# EAGLE design G020H (EAGLE 6.6.0)
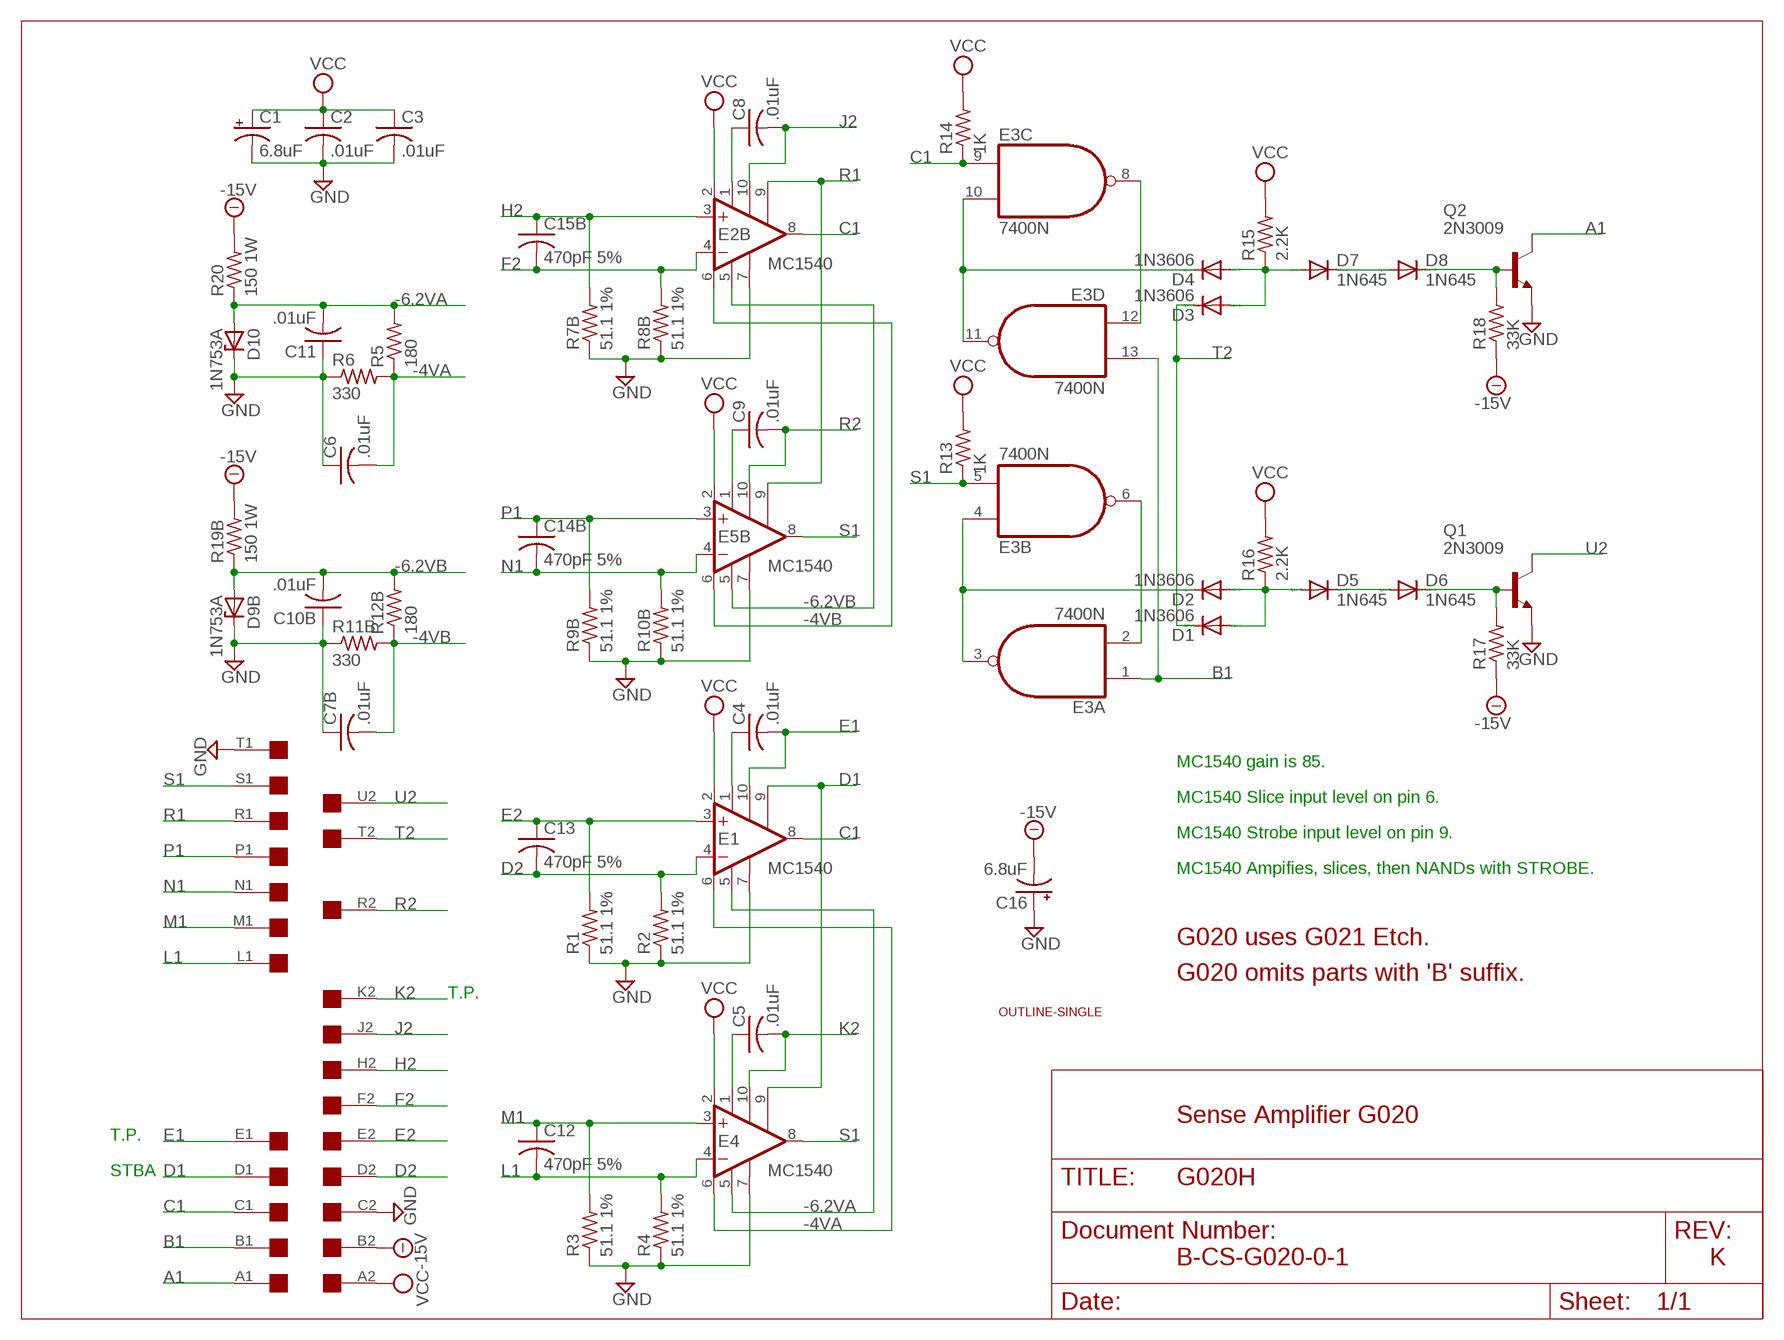
[diagram p0: schematic, sheet 1]

## Parts
C1  6.8uF  CPOL-USE20-8AXIAL  [E12-8]
C2  .01uF  C-US050-025X075  [C050-025X075]
C3  .01uF  C-US050-025X075  [C050-025X075]
C4  .01uF  C-US050-025X075  [C050-025X075]
C5  .01uF  C-US050-025X075  [C050-025X075]
C6  .01uF  C-US050-025X075  [C050-025X075]
C7B  .01uF  C-US050-025X075  [C050-025X075]
C8  .01uF  C-US050-025X075  [C050-025X075]
C9  .01uF  C-US050-025X075  [C050-025X075]
C10B  .01uF  C-US050-025X075  [C050-025X075]
C11  .01uF  C-US050-025X075  [C050-025X075]
C12  470pF 5%  C-US050-025X075  [C050-025X075]
C13  470pF 5%  C-US050-025X075  [C050-025X075]
C14B  470pF 5%  C-US050-025X075  [C050-025X075]
C15B  470pF 5%  C-US050-025X075  [C050-025X075]
C16  6.8uF  CPOL-USE20-8AXIAL  [E12-8]
D1  1N3606  1N4148DO35-10  [DO35-10]
D2  1N3606  1N4148DO35-10  [DO35-10]
D3  1N3606  1N4148DO35-10  [DO35-10]
D4  1N3606  1N4148DO35-10  [DO35-10]
D5  1N645  1N4148DO35-10  [DO35-10]
D6  1N645  1N4148DO35-10  [DO35-10]
D7  1N645  1N4148DO35-10  [DO35-10]
D8  1N645  1N4148DO35-10  [DO35-10]
D9B  1N753A  ZENER-DIODEDO35Z10  [DO35Z10]
D10  1N753A  ZENER-DIODEDO35Z10  [DO35Z10]
E1  MC1540  MC1540G  [602B]
E2B  MC1540  MC1540G  [602B]
E3  7400N  [DIL14]
E4  MC1540  MC1540G  [602B]
E5B  MC1540  MC1540G  [602B]
Q1  2N3009  2N2219  [TO5]
Q2  2N3009  2N2219  [TO5]
R1  51.1 1%  R-US_0207/15  [0207/15]
R2  51.1 1%  R-US_0207/15  [0207/15]
R3  51.1 1%  R-US_0207/15  [0207/15]
R4  51.1 1%  R-US_0207/15  [0207/15]
R5  180  R-US_0207/10  [0207/10]
R6  330  R-US_0207/10  [0207/10]
R7B  51.1 1%  R-US_0207/15  [0207/15]
R8B  51.1 1%  R-US_0207/15  [0207/15]
R9B  51.1 1%  R-US_0207/15  [0207/15]
R10B  51.1 1%  R-US_0207/15  [0207/15]
R11B  330  R-US_0207/10  [0207/10]
R12B  180  R-US_0207/10  [0207/10]
R13  1K  R-US_0207/10  [0207/10]
R14  1K  R-US_0207/10  [0207/10]
R15  2.2K  R-US_0207/10  [0207/10]
R16  2.2K  R-US_0207/10  [0207/10]
R17  33K  R-US_0207/10  [0207/10]
R18  33K  R-US_0207/10  [0207/10]
R19B  150 1W  R-US_0414/20  [0414/20]
R20  150 1W  R-US_0414/20  [0414/20]
U$1  SINGLE  [EDGE-CON2]
U$2  OUTLINE-SINGLE  [SINGLE]

## Nets
-4VA: C6.2 E1.6(SLICE) E4.6(SLICE) R5.1 R6.2
-4VB: C7B.2 E2B.6(SLICE) E5B.6(SLICE) R11B.2 R12B.1
-6.2VA: C11.2 D10.A E1.5(V-) E4.5(V-) R5.2 R20.1
-6.2VB: C10B.2 D9B.A E2B.5(V-) E5B.5(V-) R12B.2 R19B.1
-15V [Supply]: C16.- R17.1 R18.1 R19B.2 R20.2 U$1.B2
A1: Q2.3(C) U$1.A1
B1: E3.1(A:I0) E3.13(D:I1) U$1.B1
C1: E1.8(OUT) E2B.8(OUT) E3.9(C:I0) R14.1 U$1.C1
D1: E1.9(ISTROBE) E4.9(ISTROBE) U$1.D1
D2: C13.2 E1.4(-IN) R2.2 U$1.D2
E1: C4.2 E1.10(CEXTB) U$1.E1
E2: C13.1 E1.3(+IN) R1.2 U$1.E2
F2: C15B.2 E2B.4(-IN) R8B.2 U$1.F2
GND [Supply]: C1.- C2.2 C3.2 C6.1 C7B.1 C10B.1 C11.1 C16.+ D9B.C D10.C E1.7(GND) E2B.7(GND) E4.7(GND) E5B.7(GND) Q1.1(E) Q2.1(E) R1.1 R2.1 R3.1 R4.1 R6.1 R7B.1 R8B.1 R9B.1 R10B.1 R11B.1 U$1.C2 U$1.T1
H2: C15B.1 E2B.3(+IN) R7B.2 U$1.H2
J2: C8.2 E2B.10(CEXTB) U$1.J2
K2: C5.2 E4.10(CEXTB) U$1.K2
L1: C12.2 E4.4(-IN) R4.2 U$1.L1
M1: C12.1 E4.3(+IN) R3.2 U$1.M1
N1: C14B.2 E5B.4(-IN) R10B.2 U$1.N1
N$1: C4.1 E1.1(CEXTA)
N$2: C8.1 E2B.1(CEXTA)
N$3: C5.1 E4.1(CEXTA)
N$4: C9.1 E5B.1(CEXTA)
N$5: E3.8(C:O) E3.12(D:I0)
N$6: D1.A D2.A D5.A R16.1
N$7: D4.C E3.10(C:I1) E3.11(D:O)
N$8: D2.C E3.3(A:O) E3.4(B:I0)
N$9: E3.2(A:I1) E3.6(B:O)
N$10: D3.A D4.A D7.A R15.1
N$11: D7.C D8.A
N$12: D5.C D6.A
N$13: D8.C Q2.2(B) R18.2
N$14: D6.C Q1.2(B) R17.2
P1: C14B.1 E5B.3(+IN) R9B.2 U$1.P1
R1: E2B.9(ISTROBE) E5B.9(ISTROBE) U$1.R1
R2: C9.2 E5B.10(CEXTB) U$1.R2
S1: E3.5(B:I1) E4.8(OUT) E5B.8(OUT) R13.1 U$1.S1
T2: D1.C D3.C U$1.T2
U2: Q1.3(C) U$1.U2
VCC [Supply]: C1.+ C2.1 C3.1 E1.2(V+) E2B.2(V+) E4.2(V+) E5B.2(V+) R13.2 R14.2 R15.2 R16.2 U$1.A2
Unconnected: U$1.F1 U$1.H1 U$1.J1 U$1.K1 U$1.L2 U$1.M2 U$1.N2 U$1.P2 U$1.S2 U$1.U1 U$1.V1 U$1.V2

## Notes on the sheet
- MC1540 gain is 85.
- MC1540 Slice input level on pin 6.
- MC1540 Strobe input level on pin 9.
- MC1540 Ampifies, slices, then NANDs with STROBE.
- G020 uses G021 Etch.
- G020 omits parts with 'B' suffix.
- T.P.
- Sense Amplifier G020
- T.P.
- STBA
- B-CS-G020-0-1 | K

## Power pins joined to a net without a drawn wire
GND: E3.7(P:GND)
VCC: E3.14(P:VCC)

## Library data of the parts
C1 C16 = dec-con:CPOL-USE20-8AXIAL: A 0.8 inch electrolytic.
C2-C6 C7B C8 C9 C10B C11-C13 C14B C15B = rcl:C-US: CAPACITOR, American symbol
D1-D8 = diode:1N4148: DIODE high speed (Philips)
D9B D10 = diode:ZENER-DIODE: Z-Diode
E1 E2B E4 E5B = dec-con:MC1540: OP AMP
E3 = 74xx-us:74*00: Quad 2-input NAND gate
Q1 Q2 = transistor-npn:2N2219: NPN Transistor
R1-R6 R7B R8B R9B R10B R11B R12B R13-R18 = rcl:R-US_: RESISTOR, American symbol
R19B R20 = dec-con:R-US_0414/20: 0.8" Resistor
U$1 = dec-con:SINGLE: Single-Height DEC board
U$2 = dec-con:OUTLINE-*: Board outlines for DEC boards.

## Net classes
1 Supply: width 0.813 mm

## Board
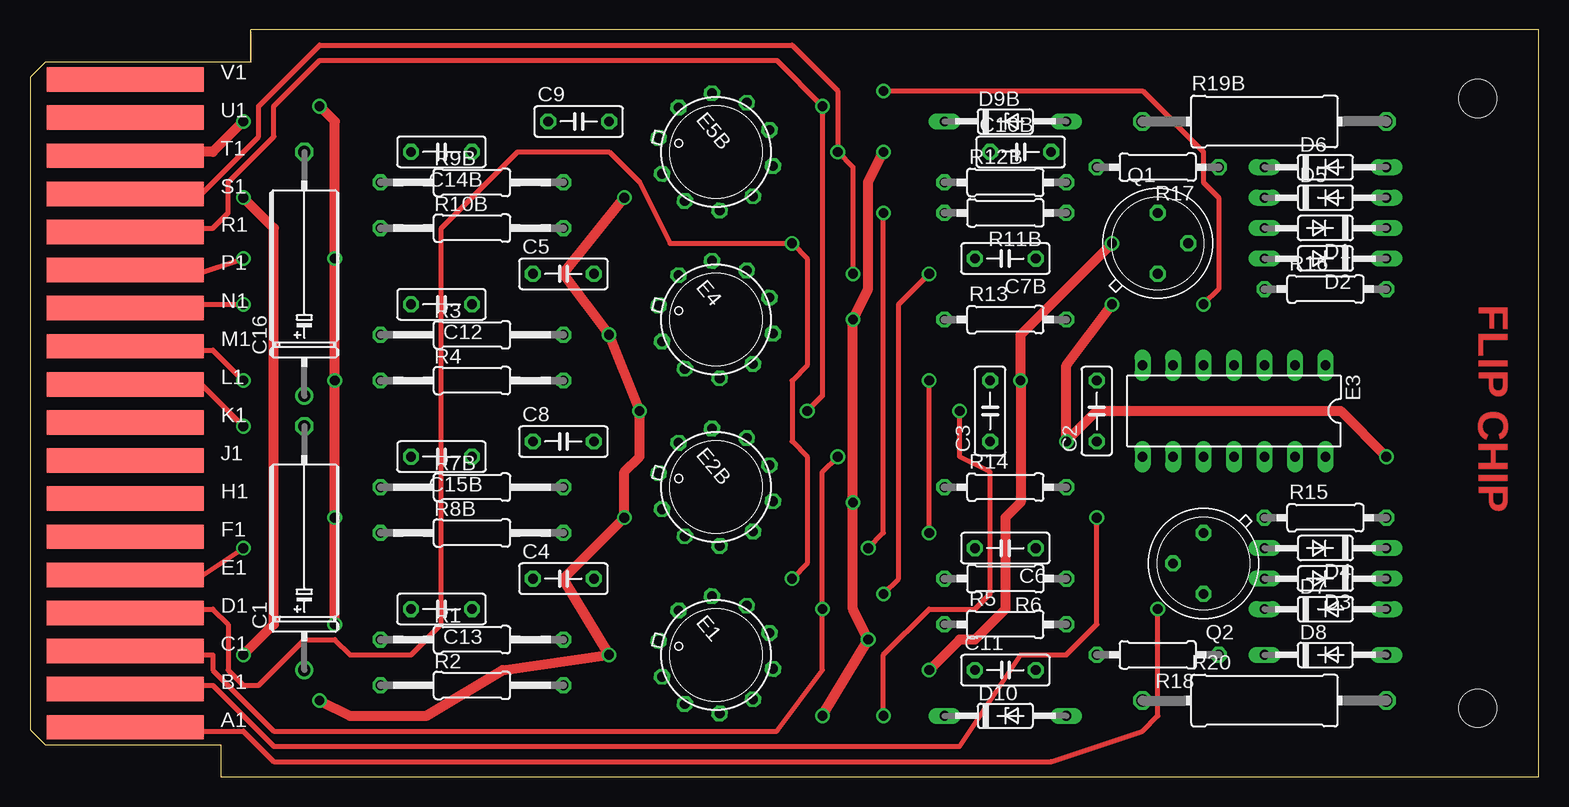
[diagram p1: board, top side]
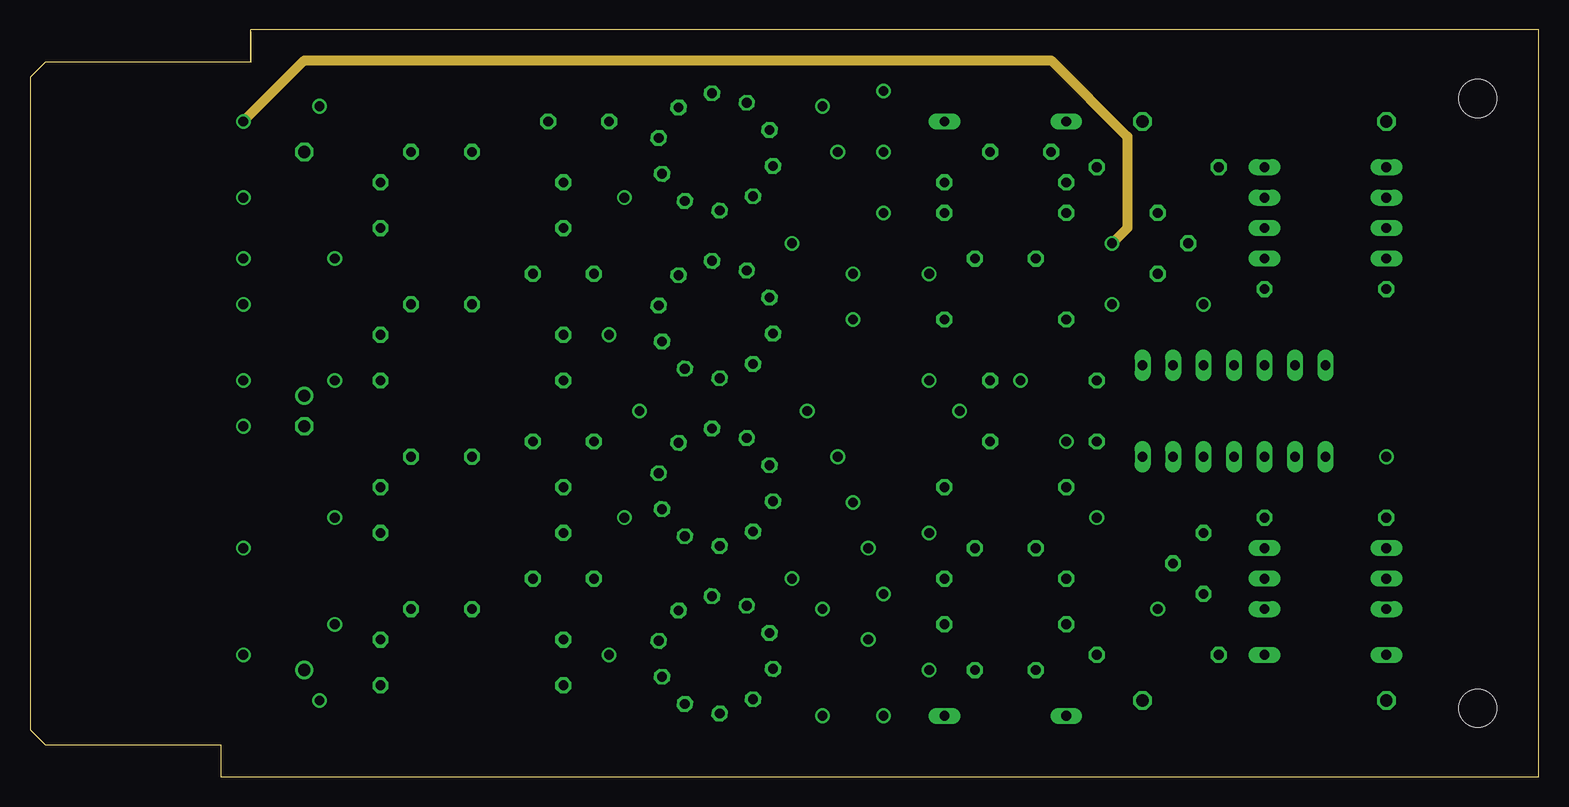
[diagram p2: board, inner layer ECO]
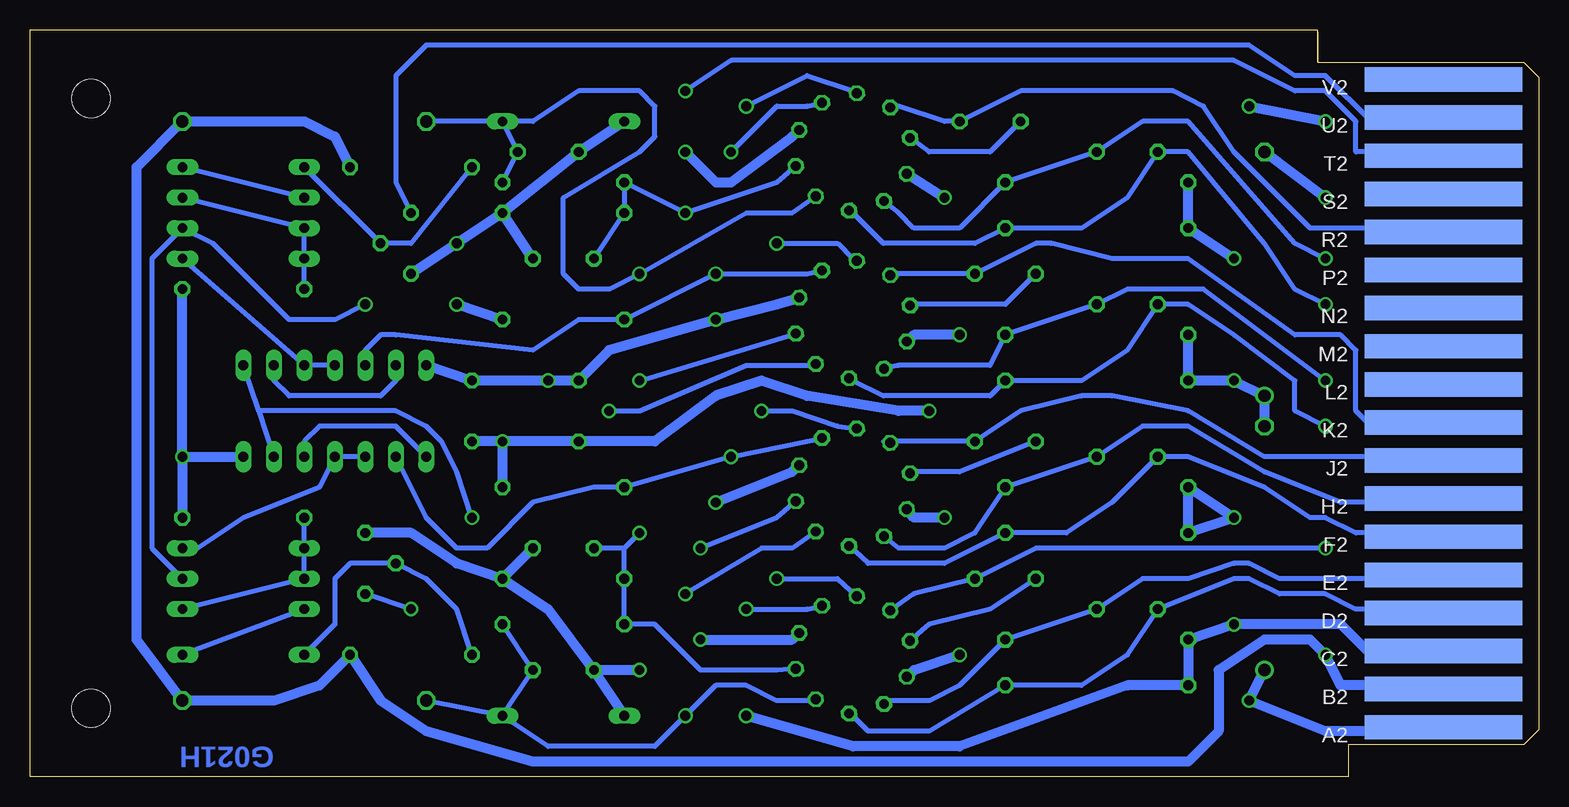
[diagram p3: board, bottom side, seen from below]

Size 125.73 x 62.23 mm. Coordinates in mm from the lower left corner, seen from the top.
Copper layers (1+2+16): Top 0.035mm / dielectric 1.5mm / ECO 0.035mm / dielectric 0.15mm / Bottom 0.035mm
Design rules "16mils": minimum track width 16mil, minimum drill 32mil, track to track 15mil, track to pad 10mil, pad to pad 10mil, via to via 10mil, smd to smd 10mil, copper to edge 13mil, drill to drill 10mil, minimum pad ring 10mil, minimum via ring 8mil, stop-mask expansion 0mil, vias tented up to drill 0mil, thermal gap 10mil

### Footprints (pad centres in the part's own frame; a part is rotated, then mirrored left to right if it is on the bottom)
E12-8 = drill 1.016: + -10.16,0 | drill 1.016 octagon: - 10.16,0
C050-025X075 = drill 0.813 octagon: 1 -2.54,0; 2 2.54,0
DO35-10 = drill 0.813 long: A 5.08,0; C -5.08,0
DO35Z10 = drill 0.813 long: A 5.08,0; C -5.08,0
602B = drill 0.813 octagon: 1 -3.954,-2.897; 2 -1.478,-4.605; 3 1.478,-4.605; 4 3.954,-2.897; 5 4.825,0; 6 3.954,2.897; 7 1.478,4.605; 8 -1.477,4.605; 9 -3.954,2.897; 10 -4.825,0
DIL14 = drill 0.813 long: 1 -7.62,-3.81; 2 -5.08,-3.81; 3 -2.54,-3.81; 4 0,-3.81; 5 2.54,-3.81; 6 5.08,-3.81; 7 7.62,-3.81; 8 7.62,3.81; 9 5.08,3.81; 10 2.54,3.81; 11 0,3.81; 12 -2.54,3.81; 13 -5.08,3.81; 14 -7.62,3.81
TO5 = drill 0.813 octagon: 1 0,-2.54; 2 2.54,0; 3 0,2.54
0207/15 = drill 0.813 octagon: 1 -7.62,0; 2 7.62,0
0207/10 = drill 0.813 octagon: 1 -5.08,0; 2 5.08,0
0414/20 = drill 1.016 octagon: 1 -10.16,0; 2 10.16,0
EDGE-CON2 = smd 13.106 x 2.032: A1 7.938,4.128; B1 7.938,7.303; C1 7.938,10.477; D1 7.938,13.652; E1 7.938,16.828; F1 7.938,20.003; H1 7.938,23.177; J1 7.938,26.352; K1 7.938,29.527; L1 7.938,32.703; M1 7.938,35.877; N1 7.938,39.053; P1 7.938,42.227; R1 7.938,45.403; S1 7.938,48.578; T1 7.938,51.752; U1 7.938,54.928; V1 7.938,58.102 | smd 13.106 x 2.032 bottom: A2 7.938,4.128; B2 7.938,7.303; C2 7.938,10.477; D2 7.938,13.652; E2 7.938,16.828; F2 7.938,20.003; H2 7.938,23.177; J2 7.938,26.352; K2 7.938,29.527; L2 7.938,32.703; M2 7.938,35.877; N2 7.938,39.053; P2 7.938,42.227; R2 7.938,45.403; S2 7.938,48.578; T2 7.938,51.752; U2 7.938,54.928; V2 7.938,58.102
SINGLE = hole 3.175: 120.65,56.515; 120.65,5.715

### Placement (x,y rotation side)
C1  22.86,19.05 90 top
C2  88.9,30.48 90 top
C3  80.01,30.48 90 top
C4  44.45,16.51 0 top
C5  44.45,41.91 0 top
C6  81.28,19.05 180 top
C7B  81.28,43.18 180 top
C8  44.45,27.94 0 top
C9  45.72,54.61 0 top
C10B  82.55,52.07 0 top
C11  81.28,8.89 0 top
C12  34.29,39.37 180 top
C13  34.29,13.97 180 top
C14B  34.29,52.07 180 top
C15B  34.29,26.67 180 top
C16  22.86,41.91 90 top
D1  107.95,45.72 180 top
D2  107.95,43.18 180 top
D3  107.95,16.51 180 top
D4  107.95,19.05 180 top
D5  107.95,48.26 0 top
D6  107.95,50.8 0 top
D7  107.95,13.97 0 top
D8  107.95,10.16 0 top
D9B  81.28,54.61 0 top
D10  81.28,5.08 0 top
E1  57.15,10.16 310 top
E2B  57.15,24.13 310 top
E3  100.33,30.48 180 top
E4  57.15,38.1 310 top
E5B  57.15,52.07 310 top
Q1  93.98,44.45 0 top
Q2  97.79,17.78 180 top
R1  36.83,11.43 0 top
R2  36.83,7.62 0 top
R3  36.83,36.83 0 top
R4  36.83,33.02 0 top
R5  81.28,12.7 0 top
R6  81.28,16.51 180 top
R7B  36.83,24.13 0 top
R8B  36.83,20.32 0 top
R9B  36.83,49.53 0 top
R10B  36.83,45.72 0 top
R11B  81.28,46.99 180 top
R12B  81.28,49.53 0 top
R13  81.28,38.1 0 top
R14  81.28,24.13 0 top
R15  107.95,21.59 0 top
R16  107.95,40.64 0 top
R17  93.98,50.8 180 top
R18  93.98,10.16 180 top
R19B  102.87,54.61 0 top
R20  102.87,6.35 0 top
U$1  0,0 0 top
U$2  0,0 0 top

### Tracks (layer width: path | path; a pad name or v marks a point on that pad's centre or on a via)
-4VA  (via drill 0.81)
  Top 0.406: v74.93,20.32 v74.93,33.02
  Bottom 0.406: E1.6 63.5,8.89 69.85,8.89 73.66,12.7 R5.1 R6.2 76.2,19.05 | 76.2,19.05 C6.2 | 76.2,19.05 v74.93,20.32 | E4.6 62.23,36.83 v74.93,33.02
-4VB  (via drill 0.81)
  Top 0.406: v69.85,19.05 71.12,20.32 v71.12,46.99
  Bottom 0.406: E2B.6 63.5,21.59 v69.85,19.05 | E5B.6 63.5,49.53 v71.12,46.99 R12B.1 R11B.2 C7B.2
-6.2VA  (via drill 0.81)
  Top 0.406: v71.12,5.08 71.12,10.16 74.93,13.97 78.74,13.97 80.01,15.24 80.01,25.4 77.47,26.67 v77.47,30.48
  Bottom 0.406: E1.5 60.96,6.35 63.5,6.35 66.04,7.62 68.58,7.62 v71.12,5.08 73.66,2.54 82.55,2.54 D10.A | E4.5 60.96,34.29 66.04,34.29 74.93,30.48 v77.47,30.48 | D10.A C11.2 R5.2 | D10.A R20.1
-6.2VB  (via drill 0.81)
  Top 0.406: v74.93,41.91 72.39,39.37 72.39,16.51 v71.12,15.24
  Bottom 0.406: E2B.5 62.23,19.05 64.77,19.05 v71.12,15.24 | E5B.5 62.23,46.99 66.04,46.99 v74.93,41.91 77.47,40.64 80.01,40.64 81.28,41.91 81.28,48.26 74.93,52.07 73.66,53.34 73.66,55.88 74.93,57.15 80.01,57.15 83.82,54.61 D9B.A | D9B.A R19B.1 | D9B.A C10B.2 R12B.2
-15V  (via drill 0.81)
  Top 0.813: v17.78,48.26 20.32,45.72 20.32,12.7 v17.78,10.16
  Bottom 0.813: U$1.B2 8.89,7.62 16.51,7.62 v17.78,10.16 19.05,11.43 22.86,11.43 26.67,8.89 26.67,3.81 29.21,1.27 83.82,1.27 92.71,3.81 96.52,6.35 R18.1 101.6,7.62 105.41,6.35 R20.2 116.84,11.43 116.84,50.8 R19B.2 102.87,54.61 100.33,53.34 R17.1 | v17.78,48.26 C16.-
A1  (via drill 0.81)
  Top 0.406: U$1.A1 8.89,3.81 17.78,3.81 20.32,1.27 85.09,1.27 92.71,3.81 93.98,5.08 v93.98,13.97
  Bottom 0.406: v93.98,13.97 Q2.3
B1  (via drill 0.81)
  Top 0.406: U$1.B1 8.89,7.62 15.24,7.62 20.32,2.54 77.47,2.54 82.55,10.16 86.36,10.16 88.9,12.7 v88.9,21.59
  Bottom 0.406: 106.68,30.48 E3.13 | 106.68,30.48 E3.1 | 106.68,30.48 95.25,30.48 92.71,29.21 91.44,27.94 90.17,25.4 v88.9,21.59
C1  (via drill 0.81)
  Top 0.406: U$1.C1 8.89,10.16 15.24,10.16 15.24,8.89 20.32,3.81 62.23,3.81 66.04,8.89 v66.04,13.97 66.04,25.4 v67.31,26.67
  Bottom 0.406: E1.8 60.96,13.97 v66.04,13.97 | E2B.8 60.96,27.94 v67.31,26.67 R14.1 78.74,24.13 83.82,22.86 87.63,19.05 90.17,19.05 92.71,21.59 E3.9
D1  (via drill 0.81)
  Top 0.406: U$1.D1 8.89,13.97 15.24,13.97 16.51,12.7 16.51,8.89 17.78,7.62 19.05,7.62 22.86,11.43 25.4,11.43 26.67,10.16 31.75,10.16 34.29,12.7 34.29,45.72 40.64,52.07 48.26,52.07 50.8,49.53 53.34,44.45 v63.5,44.45 64.77,43.18 64.77,34.29 63.5,33.02 63.5,27.94 64.77,26.67 64.77,17.78 v63.5,16.51
  Bottom 0.406: E1.9 58.42,16.51 v63.5,16.51 | E4.9 57.15,43.18 58.42,44.45 v63.5,44.45
D2
  Bottom 0.406: E1.4 57.15,5.08 55.88,3.81 50.8,3.81 R2.2 38.1,7.62 34.29,10.16 C13.2 25.4,16.51 24.13,16.51 21.59,15.24 17.78,15.24 15.24,13.97 8.89,13.97 U$1.D2
E1  (via drill 0.81)
  Top 0.406: U$1.E1 8.89,16.51 13.97,16.51 v17.78,19.05
  Bottom 0.406: E1.10 52.07,15.24 C4.2 41.91,19.05 v17.78,19.05
E2
  Bottom 0.406: E1.3 54.61,6.35 50.8,6.35 48.26,7.62 R1.2 C13.1 33.02,16.51 29.21,16.51 25.4,17.78 24.13,17.78 21.59,16.51 8.89,16.51 U$1.E2
F2
  Bottom 0.406: U$1.F2 8.89,20.32 15.24,20.32 17.78,21.59 19.05,21.59 22.86,24.13 29.21,26.67 C15B.2 35.56,22.86 39.37,20.32 R8B.2 49.53,17.78 55.88,17.78 E2B.4
GND  (via drill 0.81)
  Top 0.813: U$1.T1 8.89,52.07 15.24,52.07 v17.78,54.61 | v24.13,55.88 25.4,54.61 v25.4,43.18 v25.4,33.02 v25.4,21.59 v25.4,12.7 | v66.04,5.08 v69.85,11.43 68.58,13.97 v68.58,22.86 v68.58,38.1 69.85,40.64 69.85,49.53 v71.12,52.07 | v90.17,44.45 82.55,36.83 v82.55,33.02 82.55,22.86 81.28,21.59 81.28,13.97 78.74,11.43 77.47,11.43 v74.93,8.89
  ECO 0.813: v17.78,54.61 22.86,59.69 85.09,59.69 91.44,53.34 91.44,45.72 v90.17,44.45
  Bottom 0.813: E1.7 62.23,11.43 v69.85,11.43 | U$1.C2 8.89,10.16 13.97,10.16 16.51,12.7 v25.4,12.7 R1.1 R2.1 34.29,7.62 48.26,2.54 57.15,2.54 v66.04,5.08 | E2B.7 62.23,25.4 v68.58,22.86 | C1.- C16.+ v25.4,33.02 R4.1 R3.1 | R9B.1 R10B.1 v25.4,43.18 | R11B.1 v90.17,44.45 Q1.1 | E4.7 63.5,39.37 v68.58,38.1 77.47,35.56 C3.2 v82.55,33.02 C2.2 E3.7 | E5B.7 62.23,53.34 67.31,49.53 68.58,49.53 v71.12,52.07 | R11B.1 C7B.1 | Q2.1 93.98,20.32 90.17,17.78 R6.1 | R6.1 C6.1 | v74.93,8.89 C11.1 | C11.1 D10.C | R6.1 82.55,13.97 C11.1 | D9B.C C10B.1 R11B.1 | v24.13,55.88 v17.78,54.61 | R8B.1 R7B.1 v25.4,21.59 R8B.1
H2
  Bottom 0.406: U$1.H2 8.89,22.86 16.51,22.86 22.86,25.4 29.21,29.21 33.02,29.21 C15B.1 R7B.2 46.99,20.32 49.53,19.05 53.34,19.05 E2B.3
J2
  Bottom 0.406: U$1.J2 8.89,26.67 22.86,26.67 29.21,30.48 35.56,31.75 38.1,31.75 43.18,30.48 C8.2 54.61,27.94 E2B.10
K2
  Bottom 0.406: U$1.K2 8.89,29.21 13.97,29.21 15.24,30.48 15.24,35.56 16.51,36.83 20.32,36.83 29.21,43.18 35.56,43.18 40.64,44.45 41.91,44.45 C5.2 53.34,41.91 E4.10
L1  (via drill 0.81)
  Top 0.406: U$1.L1 8.89,33.02 13.97,33.02 v17.78,29.21
  Bottom 0.406: v17.78,29.21 20.32,30.48 20.32,33.02 25.4,36.83 29.21,39.37 C12.2 34.29,35.56 38.1,33.02 R4.2 45.72,31.75 54.61,31.75 57.15,33.02 E4.4
M1  (via drill 0.81)
  Top 0.406: U$1.M1 10.16,35.56 15.24,35.56 v17.78,33.02
  Bottom 0.406: v17.78,33.02 27.94,40.64 34.29,40.64 C12.1 R3.2 45.72,34.29 53.34,34.29 E4.3
N1  (via drill 0.81)
  Top 0.406: U$1.N1 8.89,39.37 v17.78,39.37
  Bottom 0.406: v17.78,39.37 20.32,40.64 22.86,44.45 29.21,52.07 C14B.2 34.29,48.26 38.1,45.72 R10B.2 46.99,44.45 54.61,44.45 57.15,46.99 E5B.4
N$1
  Bottom 0.406: E1.1 50.8,12.7 45.72,13.97 C4.1
N$2
  Bottom 0.406: E2B.1 52.07,25.4 48.26,25.4 C8.1
N$3
  Bottom 0.406: E4.1 52.07,39.37 44.45,39.37 C5.1
N$4
  Bottom 0.406: E5B.1 50.8,52.07 45.72,52.07 C9.1
N$5
  Bottom 0.406: E3.8 95.25,29.21 101.6,29.21 102.87,27.94 E3.12
N$6
  Bottom 0.406: D5.A D1.A D2.A R16.1
N$7
  Bottom 0.406: E3.10 E3.11 101.6,24.13 107.95,21.59 111.76,19.05 D4.C
N$8
  Bottom 0.406: E3.4 E3.3 D2.C
N$9
  Bottom 0.406: E3.6 95.25,33.02 96.52,31.75 104.14,31.75 105.41,33.02 E3.2
N$10
  Bottom 0.406: R15.1 D4.A D3.A D7.A
N$11
  Bottom 0.406: D7.C D8.A
N$12
  Bottom 0.406: D5.C D6.A
N$13
  Bottom 0.406: D8.C 100.33,12.7 100.33,16.51 99.06,17.78 Q2.2 92.71,16.51 90.17,13.97 R18.2
N$14
  Bottom 0.406: R17.2 93.98,44.45 Q1.2 D6.C
P1  (via drill 0.81)
  Top 0.406: U$1.P1 8.89,41.91 13.97,41.91 v17.78,43.18
  Bottom 0.406: E5B.3 53.34,46.99 52.07,45.72 48.26,45.72 R9B.2 C14B.1 33.02,54.61 29.21,54.61 20.32,44.45 v17.78,43.18
R1  (via drill 0.81)
  Top 0.406: v64.77,30.48 66.04,31.75 v66.04,55.88 62.23,59.69 24.13,59.69 20.32,55.88 20.32,53.34 16.51,49.53 16.51,46.99 15.24,45.72 8.89,45.72 U$1.R1
  Bottom 0.406: E2B.9 58.42,29.21 62.23,30.48 v64.77,30.48 | E5B.9 57.15,57.15 60.96,58.42 v66.04,55.88
R2
  Bottom 0.406: U$1.R2 8.89,45.72 19.05,45.72 25.4,52.07 27.94,55.88 30.48,57.15 43.18,57.15 C9.2 49.53,54.61 53.34,55.88 E5B.10
S1  (via drill 0.81)
  Top 0.406: v68.58,41.91 68.58,50.8 v67.31,52.07 67.31,57.15 63.5,60.96 24.13,60.96 19.05,55.88 19.05,53.34 13.97,48.26 8.89,48.26 U$1.S1
  Bottom 0.406: E4.8 60.96,41.91 v68.58,41.91 R13.1 80.01,38.1 83.82,35.56 95.25,36.83 96.52,36.83 97.79,35.56 E3.5 | E5B.8 60.96,55.88 63.5,55.88 v67.31,52.07
T2  (via drill 0.81)
  Top 0.406: v71.12,57.15 92.71,57.15 97.79,52.07 97.79,49.53 99.06,48.26 99.06,40.64 v97.79,39.37
  Bottom 0.406: U$1.T2 8.89,52.07 15.24,52.07 15.24,54.61 17.78,57.15 20.32,57.15 25.4,59.69 67.31,59.69 v71.12,57.15 | v97.79,39.37 100.33,38.1 104.14,38.1 110.49,44.45 D1.C 115.57,43.18 115.57,19.05 D3.C
U2
  Bottom 0.406: U$1.U2 8.89,54.61 13.97,54.61 17.78,58.42 20.32,58.42 24.13,60.96 92.71,60.96 95.25,58.42 95.25,49.53 Q1.3
VCC  (via drill 0.81)
  Top 0.813: v24.13,6.35 26.67,5.08 33.02,5.08 39.37,8.89 v48.26,10.16 44.45,16.51 v49.53,21.59 49.53,25.4 50.8,26.67 v50.8,30.48 v48.26,36.83 44.45,41.91 v49.53,48.26 | v113.03,26.67 109.22,30.48 88.9,30.48 v86.36,27.94 86.36,34.29 v90.17,39.37
  Bottom 0.813: E1.2 52.07,8.89 v48.26,10.16 | U$1.A2 8.89,3.81 17.78,3.81 v24.13,6.35 C1.+ | E2B.2 52.07,21.59 v49.53,21.59 | v113.03,26.67 R15.2 | v113.03,26.67 R16.2 | v113.03,26.67 E3.14 | v50.8,30.48 53.34,30.48 60.96,31.75 64.77,33.02 68.58,31.75 73.66,27.94 C3.1 v86.36,27.94 | v86.36,27.94 C2.1 | v86.36,27.94 R14.2 | v49.53,48.26 E5B.2 | E4.2 52.07,36.83 v48.26,36.83 | v90.17,39.37 R13.2

### Text on the board
Top: FLIP CHIP
Bottom: G021H